# Altium schematic sheet BLOCK1.SchDoc
size A3; SheetNumber: 1; SheetTotal: 12
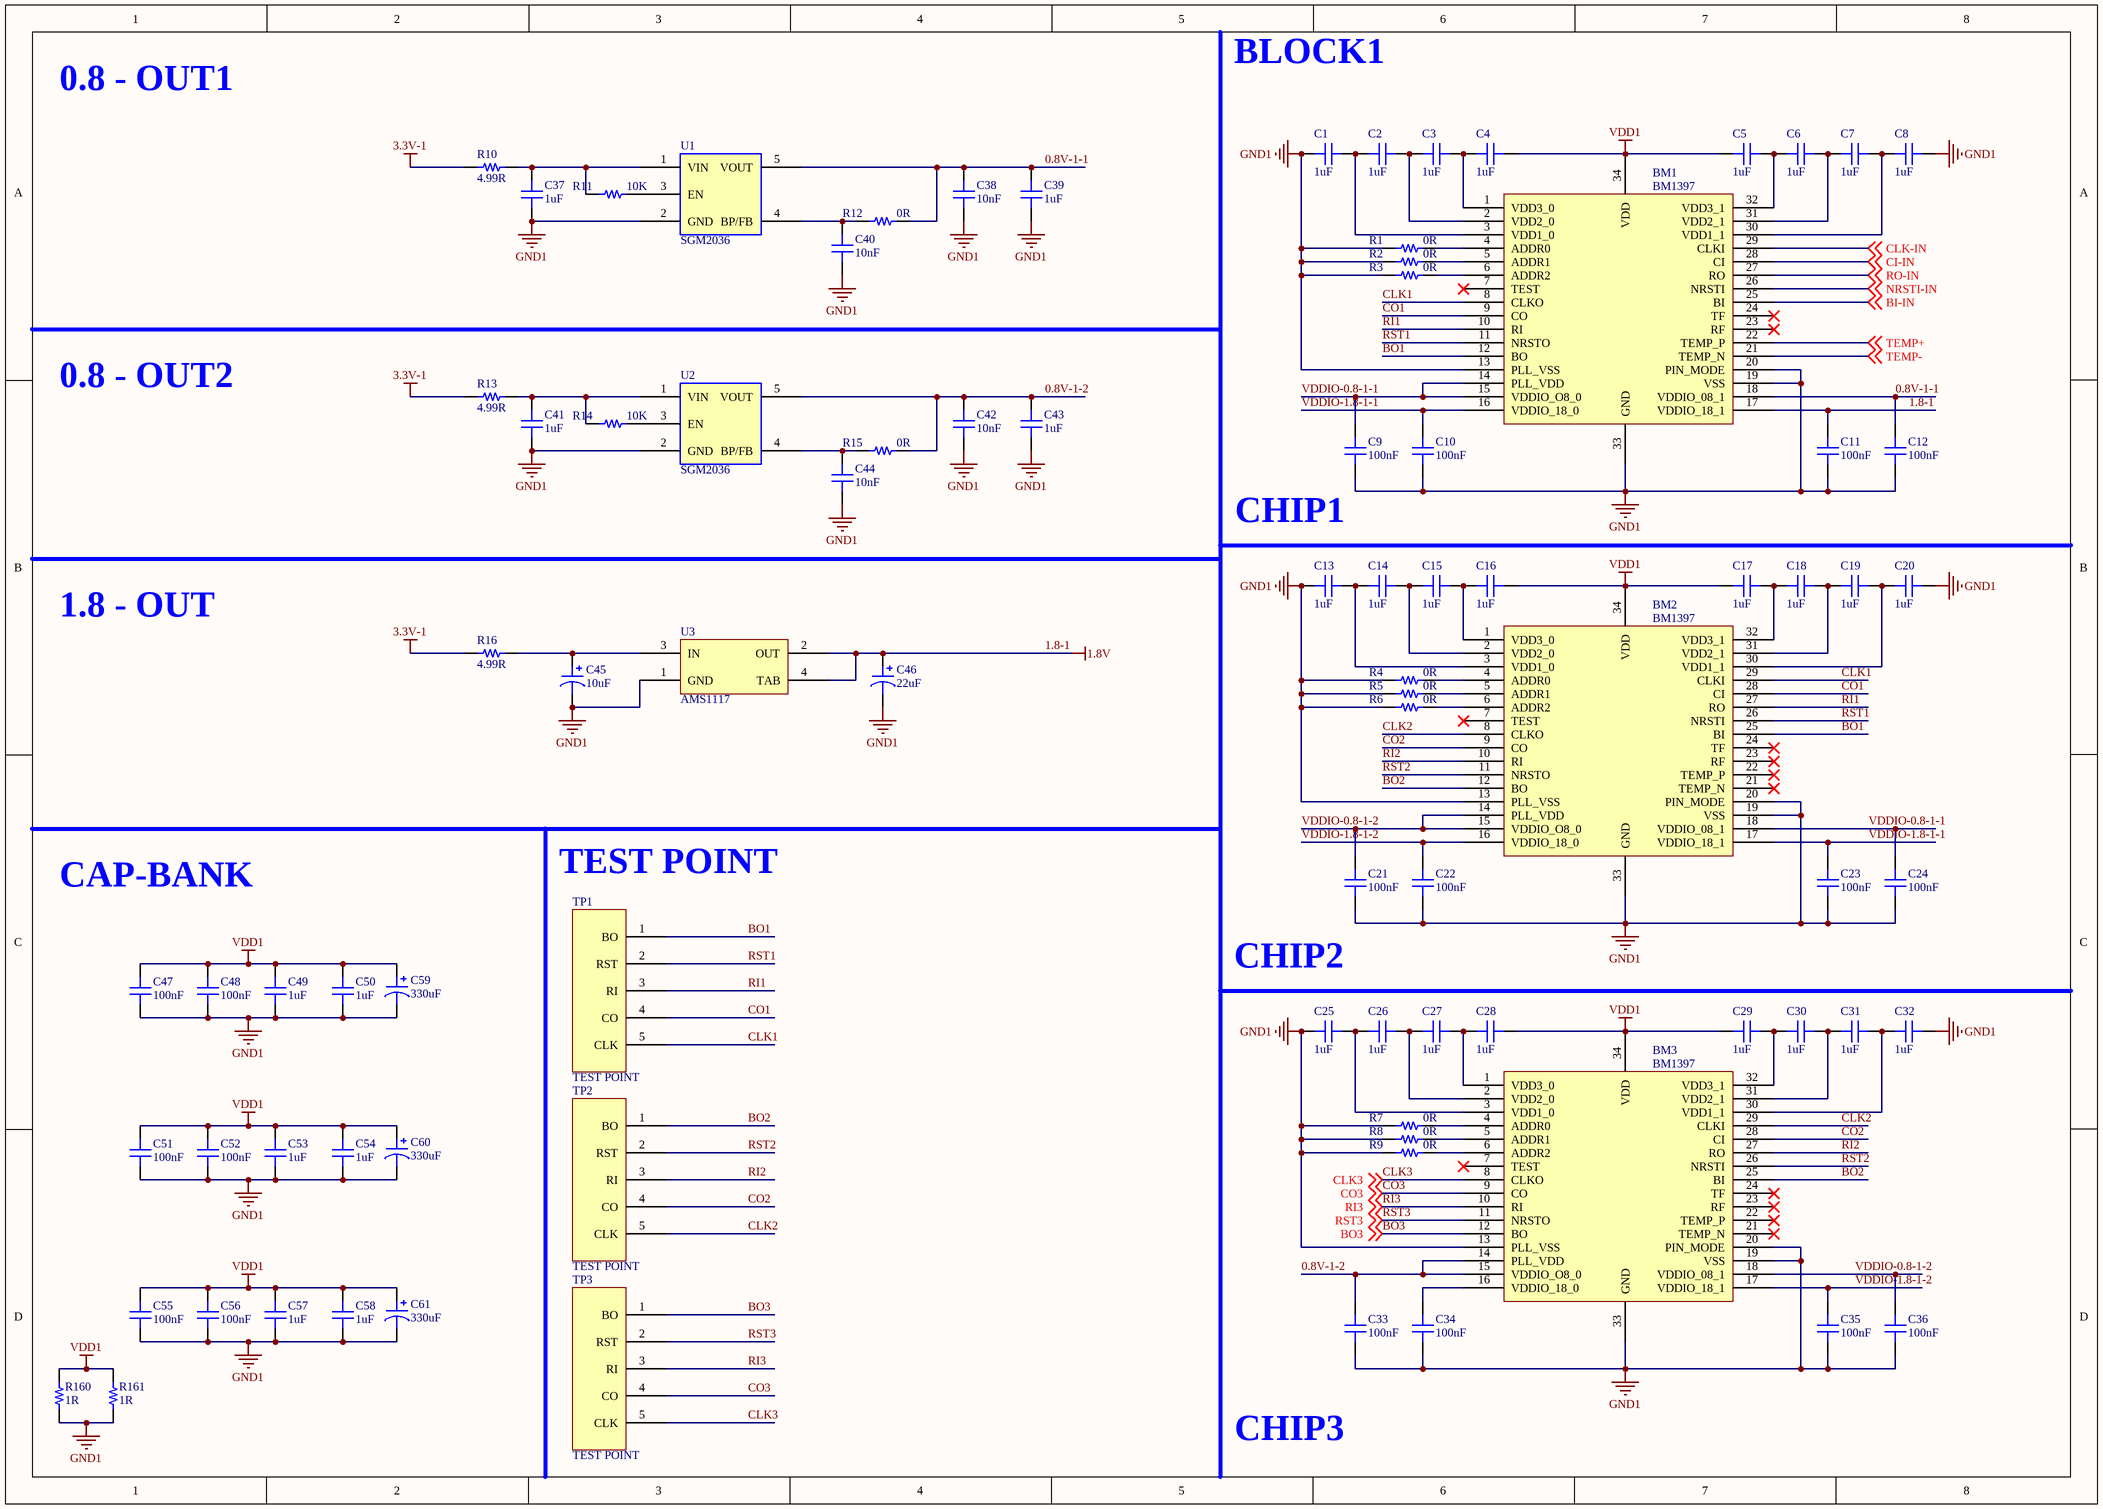
[diagram p0: BLOCK1.SchDoc]

## Parts
BM1  BM1397  [BM1387]
BM2  BM1397  [BM1387]
BM3  BM1397  [BM1387]
C1  1uF  [CAP-SMD-0603]
C2  1uF  [CAP-SMD-0603]
C3  1uF  [CAP-SMD-0603]
C4  1uF  [CAP-SMD-0603]
C5  1uF  [CAP-SMD-0603]
C6  1uF  [CAP-SMD-0603]
C7  1uF  [CAP-SMD-0603]
C8  1uF  [CAP-SMD-0603]
C9  100nF  [CAP_SMD_0805]
C10  100nF  [CAP_SMD_0805]
C11  100nF  [CAP_SMD_0805]
C12  100nF  [CAP_SMD_0805]
C13  1uF  [CAP-SMD-0603]
C14  1uF  [CAP-SMD-0603]
C15  1uF  [CAP-SMD-0603]
C16  1uF  [CAP-SMD-0603]
C17  1uF  [CAP-SMD-0603]
C18  1uF  [CAP-SMD-0603]
C19  1uF  [CAP-SMD-0603]
C20  1uF  [CAP-SMD-0603]
C21  100nF  [CAP_SMD_0805]
C22  100nF  [CAP_SMD_0805]
C23  100nF  [CAP_SMD_0805]
C24  100nF  [CAP_SMD_0805]
C25  1uF  [CAP-SMD-0603]
C26  1uF  [CAP-SMD-0603]
C27  1uF  [CAP-SMD-0603]
C28  1uF  [CAP-SMD-0603]
C29  1uF  [CAP-SMD-0603]
C30  1uF  [CAP-SMD-0603]
C31  1uF  [CAP-SMD-0603]
C32  1uF  [CAP-SMD-0603]
C33  100nF  [CAP_SMD_0805]
C34  100nF  [CAP_SMD_0805]
C35  100nF  [CAP_SMD_0805]
C36  100nF  [CAP_SMD_0805]
C37  1uF  [CAP_SMD_0805]
C38  10nF  [CAP_SMD_0805]
C39  1uF  [CAP_SMD_0805]
C40  10nF  [CAP_SMD_0805]
C41  1uF  [CAP_SMD_0805]
C42  10nF  [CAP_SMD_0805]
C43  1uF  [CAP_SMD_0805]
C44  10nF  [CAP_SMD_0805]
C45  10uF  [CAP-TAN-CASE-A]
C46  22uF  [CAP-TAN-CASE-A]
C47  100nF  [CAP_SMD_0805]
C48  100nF  [CAP_SMD_0805]
C49  1uF  [CAP_SMD_0805]
C50  1uF  [CAP_SMD_0805]
C51  100nF  [CAP_SMD_0805]
C52  100nF  [CAP_SMD_0805]
C53  1uF  [CAP_SMD_0805]
C54  1uF  [CAP_SMD_0805]
C55  100nF  [CAP_SMD_0805]
C56  100nF  [CAP_SMD_0805]
C57  1uF  [CAP_SMD_0805]
C58  1uF  [CAP_SMD_0805]
C59  330uF  [CAP-TAN-CASE-E]
C60  330uF  [CAP-TAN-CASE-E]
C61  330uF  [CAP-TAN-CASE-E]
R1  0R  [RES-SMD-0402]
R2  0R  [RES-SMD-0402]
R3  0R  [RES-SMD-0402]
R4  0R  [RES-SMD-0402]
R5  0R  [RES-SMD-0402]
R6  0R  [RES-SMD-0402]
R7  0R  [RES-SMD-0402]
R8  0R  [RES-SMD-0402]
R9  0R  [RES-SMD-0402]
R10  4.99R  [RES-SMD-1206]
R11  10K  [RES-SMD-0402]
R12  0R  [RES-SMD-0402]
R13  4.99R  [RES-SMD-1206]
R14  10K  [RES-SMD-0402]
R15  0R  [RES-SMD-0402]
R16  4.99R  [RES-SMD-1206]
R160  1R  [RES-SMD-1210]
R161  1R  [RES-SMD-1210]
TP1  TEST POINT  [TEST_POINT]
TP2  TEST POINT  [TEST_POINT]
TP3  TEST POINT  [TEST_POINT]
U1  SGM2036  [SOT23-5PIN]
U2  SGM2036  [SOT23-5PIN]
U3  AMS1117  [AMS1117]

## Nets
1.8-1: BM1.17(VDDIO_18_1) C11.2 C46.1 U3.2(OUT) U3.4(TAB)  [also labelled 1.8V]
3.3V-1: R10.1 R13.1 R16.1
GND1: BM1.13(PLL_VSS) BM1.19(VSS) BM1.20(PIN_MODE) BM1.33(GND) BM2.13(PLL_VSS) BM2.19(VSS) BM2.20(PIN_MODE) BM2.33(GND) BM3.13(PLL_VSS) BM3.19(VSS) BM3.20(PIN_MODE) BM3.33(GND) C1.1 C8.2 C9.1 C10.1 C11.1 C12.1 C13.1 C20.2 C21.1 C22.1 C23.1 C24.1 C25.1 C32.2 C33.1 C34.1 C35.1 C36.1 C37.1 C38.1 C39.1 C40.1 C41.1 C42.1 C43.1 C44.1 C45.2 C46.2 C47.1 C48.1 C49.1 C50.1 C51.1 C52.1 C53.1 C54.1 C55.1 C56.1 C57.1 C58.1 C59.2 C60.2 C61.2 R1.1 R2.1 R3.1 R4.1 R5.1 R6.1 R7.1 R8.1 R9.1 R160.1 R161.1 U1.2(GND) U2.2(GND) U3.1(GND)
VDD1: BM1.34(VDD) BM2.34(VDD) BM3.34(VDD) C4.2 C5.1 C16.2 C17.1 C28.2 C29.1 C47.2 C48.2 C49.2 C50.2 C51.2 C52.2 C53.2 C54.2 C55.2 C56.2 C57.2 C58.2 C59.1 C60.1 C61.1 R160.2 R161.2
0.8V-1-1: BM1.18(VDDIO_08_1) C12.2 C38.2 C39.2 R12.2 U1.5(VOUT)
0.8V-1-2: BM3.14(PLL_VDD) BM3.15(VDDIO_O8_0) C33.2 C42.2 C43.2 R15.2 U2.5(VOUT)
BI-IN: BM1.25(BI) ; off-sheet BI-IN
BO1: BM1.12(BO) BM2.25(BI) TP1.1(BO)
BO2: BM2.12(BO) BM3.25(BI) TP2.1(BO)
BO3: BM3.12(BO) TP3.1(BO) ; off-sheet BO3
CI-IN: BM1.28(CI) ; off-sheet CI-IN
CLK1: BM1.8(CLKO) BM2.29(CLKI) TP1.5(CLK)
CLK2: BM2.8(CLKO) BM3.29(CLKI) TP2.5(CLK)
CLK3: BM3.8(CLKO) TP3.5(CLK) ; off-sheet CLK3
CLK-IN: BM1.29(CLKI) ; off-sheet CLK-IN
CO1: BM1.9(CO) BM2.28(CI) TP1.4(CO)
CO2: BM2.9(CO) BM3.28(CI) TP2.4(CO)
CO3: BM3.9(CO) TP3.4(CO) ; off-sheet CO3
NRSTI-IN: BM1.26(NRSTI) ; off-sheet NRSTI-IN
RI1: BM1.10(RI) BM2.27(RO) TP1.3(RI)
RI2: BM2.10(RI) BM3.27(RO) TP2.3(RI)
RI3: BM3.10(RI) TP3.3(RI) ; off-sheet RI3
RO-IN: BM1.27(RO) ; off-sheet RO-IN
RST1: BM1.11(NRSTO) BM2.26(NRSTI) TP1.2(RST)
RST2: BM2.11(NRSTO) BM3.26(NRSTI) TP2.2(RST)
RST3: BM3.11(NRSTO) TP3.2(RST) ; off-sheet RST3
TEMP+: BM1.22(TEMP_P) ; off-sheet TEMP+
TEMP-: BM1.21(TEMP_N) ; off-sheet TEMP-
VDDIO-0.8-1-1: BM1.14(PLL_VDD) BM1.15(VDDIO_O8_0) BM2.18(VDDIO_08_1) C9.2 C24.2
VDDIO-0.8-1-2: BM2.14(PLL_VDD) BM2.15(VDDIO_O8_0) BM3.18(VDDIO_08_1) C21.2 C36.2
VDDIO-1.8-1-1: BM1.16(VDDIO_18_0) BM2.17(VDDIO_18_1) C10.2 C23.2
VDDIO-1.8-1-2: BM2.16(VDDIO_18_0) BM3.17(VDDIO_18_1) C22.2 C35.2
NetBM1_1: BM1.1(VDD3_0) C3.2 C4.1
NetBM1_2: BM1.2(VDD2_0) C2.2 C3.1
NetBM1_3: BM1.3(VDD1_0) C1.2 C2.1
NetBM1_4: BM1.4(ADDR0) R1.2
NetBM1_5: BM1.5(ADDR1) R2.2
NetBM1_6: BM1.6(ADDR2) R3.2
NetBM1_30: BM1.30(VDD1_1) C7.2 C8.1
NetBM1_31: BM1.31(VDD2_1) C6.2 C7.1
NetBM1_32: BM1.32(VDD3_1) C5.2 C6.1
NetBM2_1: BM2.1(VDD3_0) C15.2 C16.1
NetBM2_2: BM2.2(VDD2_0) C14.2 C15.1
NetBM2_3: BM2.3(VDD1_0) C13.2 C14.1
NetBM2_4: BM2.4(ADDR0) R4.2
NetBM2_5: BM2.5(ADDR1) R5.2
NetBM2_6: BM2.6(ADDR2) R6.2
NetBM2_30: BM2.30(VDD1_1) C19.2 C20.1
NetBM2_31: BM2.31(VDD2_1) C18.2 C19.1
NetBM2_32: BM2.32(VDD3_1) C17.2 C18.1
NetBM3_1: BM3.1(VDD3_0) C27.2 C28.1
NetBM3_2: BM3.2(VDD2_0) C26.2 C27.1
NetBM3_3: BM3.3(VDD1_0) C25.2 C26.1
NetBM3_4: BM3.4(ADDR0) R7.2
NetBM3_5: BM3.5(ADDR1) R8.2
NetBM3_6: BM3.6(ADDR2) R9.2
NetBM3_16: BM3.16(VDDIO_18_0) C34.2
NetBM3_30: BM3.30(VDD1_1) C31.2 C32.1
NetBM3_31: BM3.31(VDD2_1) C30.2 C31.1
NetBM3_32: BM3.32(VDD3_1) C29.2 C30.1
NetC37_2: C37.2 R10.2 R11.1 U1.1(VIN)
NetC40_2: C40.2 R12.1 U1.4(BP/FB)
NetC41_2: C41.2 R13.2 R14.1 U2.1(VIN)
NetC44_2: C44.2 R15.1 U2.4(BP/FB)
NetC45_1: C45.1 R16.2 U3.3(IN)
NetR11_2: R11.2 U1.3(EN)
NetR14_2: R14.2 U2.3(EN)

Not connected (* = marked no-connect by the designer): BM1 7(TEST)* 23(RF)* 24(TF)*; BM2 7(TEST)* 21(TEMP_N)* 22(TEMP_P)* 23(RF)* 24(TF)*; BM3 7(TEST)* 21(TEMP_N)* 22(TEMP_P)* 23(RF)* 24(TF)*

## Notes on the sheet
- 0.8 - OUT1
- BLOCK1
- 0.8 - OUT2
- CHIP1
- 1.8 - OUT
- CAP-BANK
- TEST POINT
- CHIP2
- CHIP3

## Library data of the parts
BM1-BM3 = BM1397_0
C1-C44 C47-C58 = CAP
C45 C46 C59-C61 = POLARIZED CAP
R1-R16 R160 R161 = RES